# Altium project BlockDetector.PrjPCB
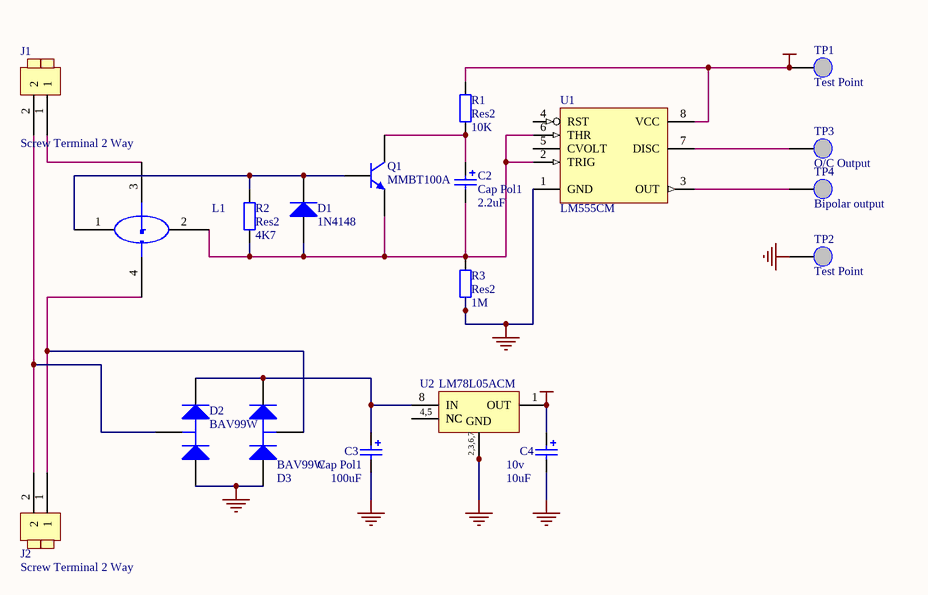
[diagram p0: Detector2.SchDoc]
1 sheet, 19 parts. Net scope: global (net labels, ports and power ports of the same name join across sheets).
Board file: BlockDetector.PcbDoc

## Sheet Detector2.SchDoc
size A3

### Parts
C2  Cap Pol1  value 2.2uF  [CC3216-1206]
C3  Cap Pol1  value 100uF  [CC3216-1206]
C4  10v  value 10uF  [CC3216-1206]
D1  1N4148  [MELF-D3516-1406]
D2  BAV99W  [SOT-323]
D3  BAV99W  [SOT-323]
J1  Screw Terminal 2 Way  [Screw Terminal 2 way 0.2]
J2  Screw Terminal 2 Way  [Screw Terminal 2 way 0.2]
L1  *  [VT-5]  (value not drawn)
Q1  MMBT100A  [SO-G3]
R1  Res2  value 10K  [CR2012-0805]
R2  Res2  value 4K7  [CR2012-0805]
R3  Res2  value 1M  [CR2012-0805]
TP1  Test Point  [TestPoint]
TP2  Test Point  [TestPoint]
TP3  O/C Output  [TestPoint]
TP4  Bipolar output  [TestPoint]
U1  LM555CM  [M08A]
U2  LM78L05ACM  [M08A]

### Nets
GND: C3.2 C4.2 D2.1(A) D3.1(A) R3.1 TP2.1 U1.1(GND) U2.2(GND) U2.3(GND) U2.6(GND) U2.7(GND)
VCC: C4.1 R1.2 TP1.1 U1.8(VCC) U2.1(OUT)
NetC2_1: C2.1 Q1.3(C) R1.1
NetC2_2: C2.2 D1.1(A) L1.2(Coil_B) Q1.2(E) R2.1 R3.2 U1.2(TRIG) U1.6(THR)
NetC3_1: C3.1 D2.2(K) D3.2(K) U2.8(IN)
NetD1_2: D1.2(K) L1.1(CoilA) Q1.1(B) R2.2
NetD2_3: D2.3(C) J1.2 J2.2
NetD3_3: D3.3(C) J2.1 L1.4(Wire_B)
NetJ1_1: J1.1 L1.3(Wire_A)
NetTP3_1: TP3.1 U1.7(DISC)
NetTP4_1: TP4.1 U1.3(OUT)
NetU2_4: U2.4(NC) U2.5(NC)

Not connected (* = marked no-connect by the designer): U1 4(RST) 5(CVOLT)

### Notes on the sheet
- (in symbol LM78L05ACM) 4,5; 2,3,6,7

### Library data of the parts
C2-C4 = Cap Pol1: Polarized Capacitor (Radial); Published: 8-Jun-2000; Revision: July-2002: Re-released for DXP Platform.; Publisher: Altium Limited
D1 = Diode 1N4148: High Conductance Fast Diode; Revision 1: 11-Jul-2000: SIM Model Added.; Revision 2: 17-Jul-2002: Re-released for DXP Platform.; Code - JEDEC: DO-204-AH; Published: 8-Jun-2000; Datasheet: Latest Revision: 1997; Package Reference: DO-35; Publisher: Altium Limited
D2 D3 = BAV99W: Silicon Switching Diode Array for High-Speed Switching; Package Information: Latest Revision: Sep-2001; Published: 21-Mar-2003; Datasheet: Latest Revision: Oct-1999; Package Reference: SOT-323; Publisher: Altium Limited
L1 = VT-5
Q1 = MMBT100A: General Purpose Amplifier NPN Silicon; Package Information: Latest Revision: 1997; Published: 29-Sep-2000; Revision: 17-Jul-2002: Re-released for DXP Platform.; Datasheet: Latest Revision: 1996; Package Reference: 318-08; Publisher: Altium Limited
R1-R3 = Res2: Resistor; Published: 8-Jun-2000; Revision: July-2002: Re-released for DXP Platform.; Publisher: Altium Limited
TP1-TP4 = TestPoint
U1 = LM555CM: Timer; Package Information: Latest Revision: Sep-1997; Code - JEDEC: MS-012-AA; Code - IPC: SO8; Published: 15-Apr-2002; Datasheet: Latest Revision: May-1997; Package Reference: M08A; Publisher: Altium Limited
U2 = LM78L05ACM: 3-Terminal Positive Regulator; Package Information: Latest Revision: Sep-1997; Code - JEDEC: MS-012-AA; Code - IPC: SO8; Published: 15-Apr-2002; Revision: 17-Sep-2003: Changed SIM name.; Datasheet: Latest Revision: Sep-1999; Package Reference: M08A; Publisher: Altium Limited